# EAGLE design Breakout3v2 (EAGLE 9.0.1)
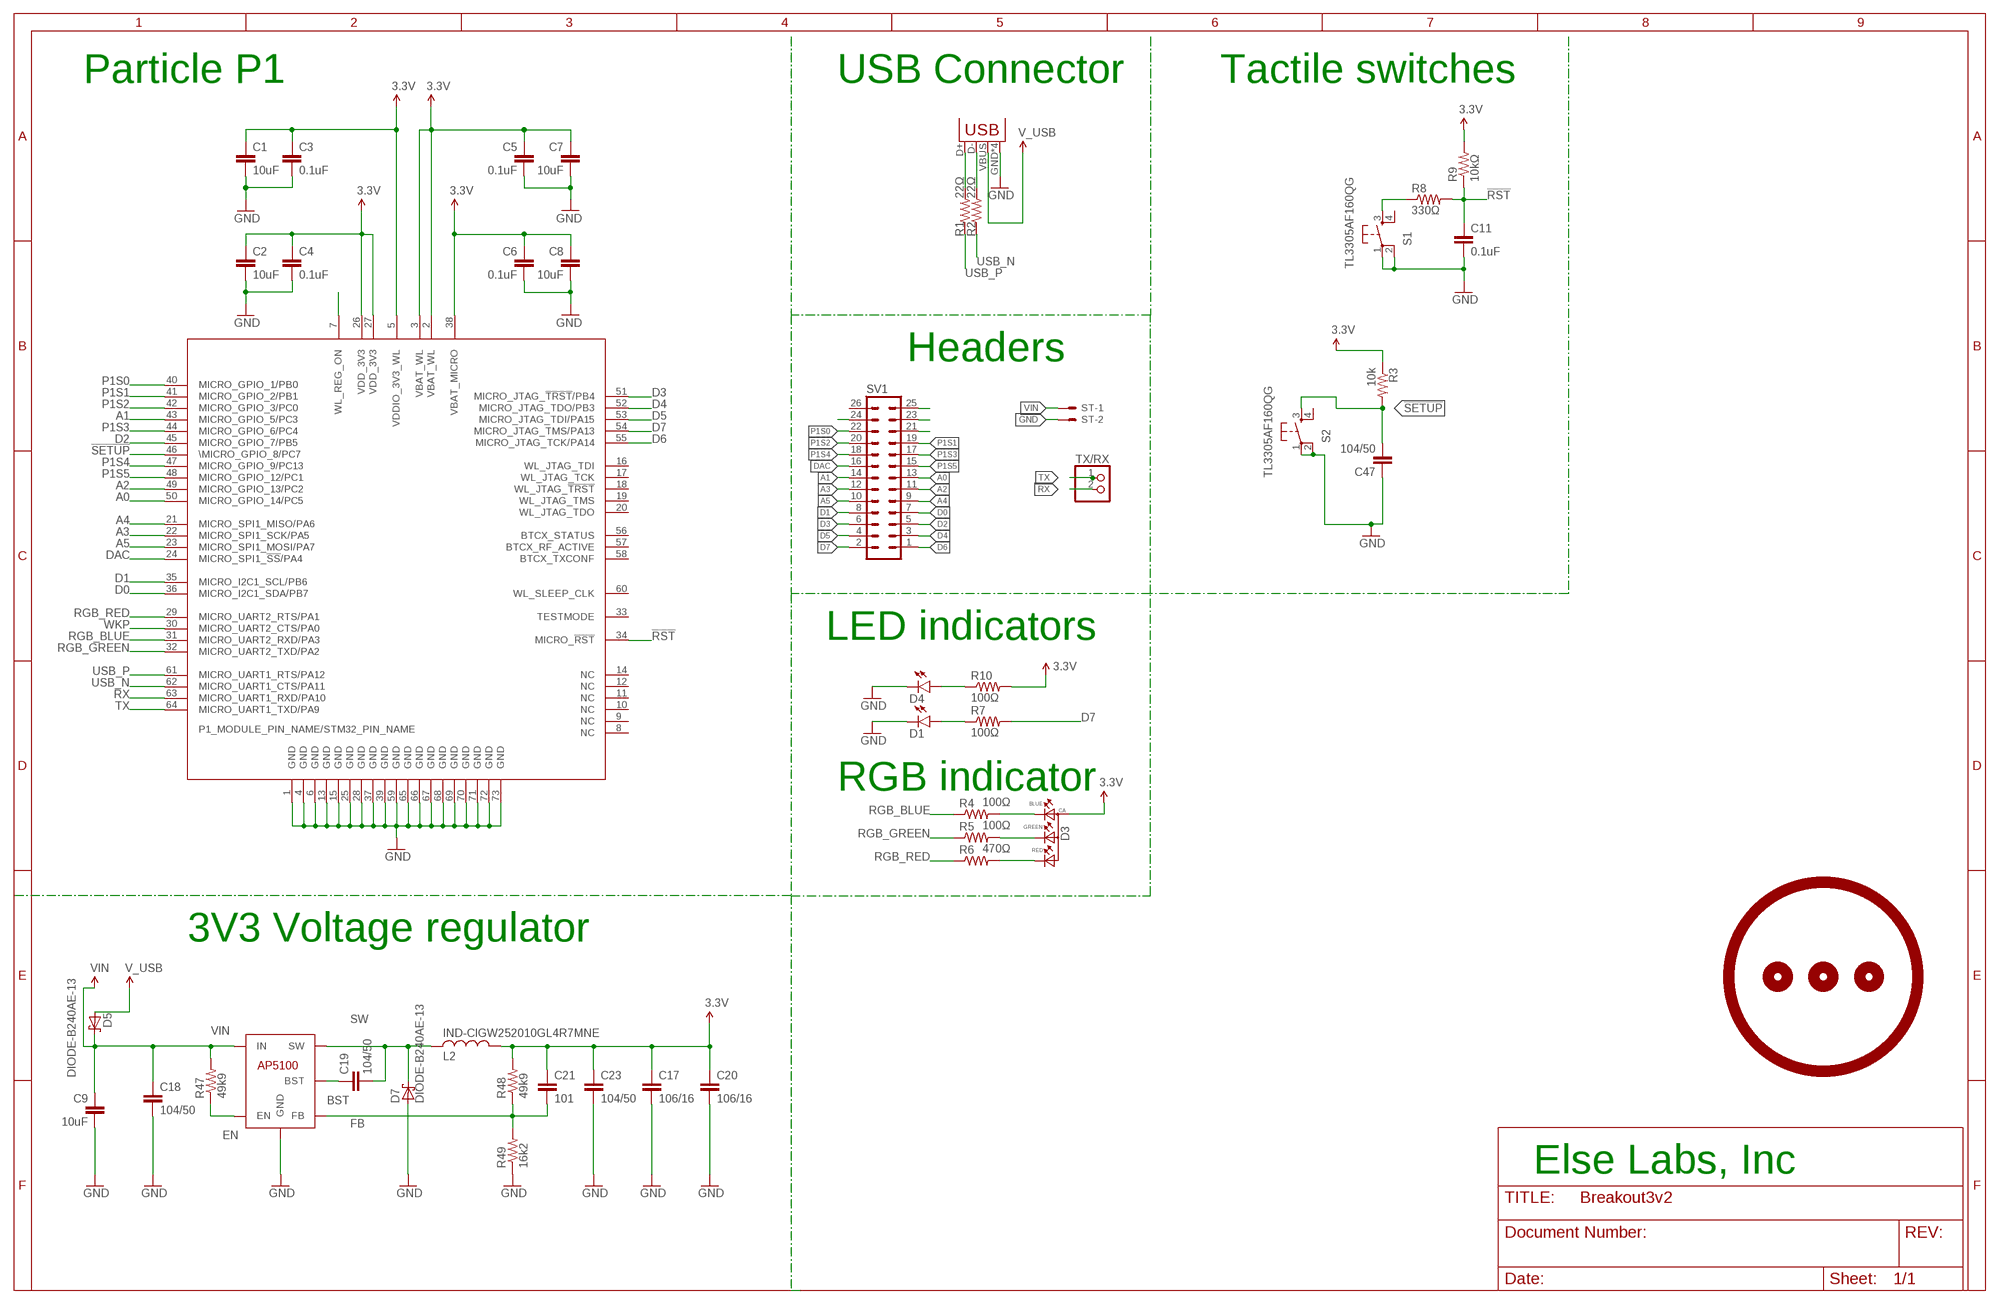
[diagram p0: schematic, sheet 1]

## Parts
C1  10uF  CAP0805  [0805]
C2  10uF  CAP0805  [0805]
C3  0.1uF  CAP0805  [0805]
C4  0.1uF  CAP0805  [0805]
C5  0.1uF  CAP0805  [0805]
C6  0.1uF  CAP0805  [0805]
C7  10uF  CAP0805  [0805]
C8  10uF  CAP0805  [0805]
C9  10uF  CAP0805  [0805]
C11  0.1uF  CAP0805  [0805]
C17  106/16  C-EUC0805  [C0805]
C18  104/50  C-EUC0603  [C0603]
C19  104/50  C-EUC0603  [C0603]
C20  106/16  C-EUC0805  [C0805]
C21  101  C-EUC0603  [C0603]
C23  104/50  C-EUC0603  [C0603]
C47  104/50  C-EUC0603  [C0603]
D1  LED0603  [LED-0603]
D3  CLVBA-FKAPLCC  [4-PLCC]
D4  LED0603  [LED-0603]
D5  DIODE-B240AE-13  [DO-214AC]
D7  DIODE-B240AE-13  [DO-214AC]
IC5  SMSP-BUCK-AP5100  [SOT23-6]
JP1  USBUSB-MICROB-SLOT-HOLE  [USB-MICROB-SLOT-HOLE]
L2  IND-CIGW252010GL4R7MNE  [L2520]
R1  22Ω  RESISTOR0805-RES  [0805]
R2  22Ω  RESISTOR0805-RES  [0805]
R3  10k  R-US_R0603  [R0603]
R4  100Ω  RESISTOR0805-RES  [0805]
R5  100Ω  RESISTOR0805-RES  [0805]
R6  470Ω  RESISTOR0805-RES  [0805]
R7  100Ω  RESISTOR0805-RES  [0805]
R8  330Ω  RESISTOR0805-RES  [0805]
R9  10kΩ  RESISTOR0805-RES  [0805]
R10  100Ω  RESISTOR0805-RES  [0805]
R47  49k9  R-US_R0603  [R0603]
R48  49k9  R-US_R0603  [R0603]
R49  16k2  R-US_R0603  [R0603]
S1  TL3305AF160QG  SWITCH-MOMENTARY-4.5MX4.5M  [TACTILE_SWITCH_SMD_4.5X4.5MM]
S2  TL3305AF160QG  SWITCH-MOMENTARY-4.5MX4.5M  [TACTILE_SWITCH_SMD_4.5X4.5MM]
ST  22-27-2021-02  [6410-02]
SV1  MA13-2  [MA13-2]
TX/RX  PINHD-1X2  [1X02]
U$1  LOGO  [LOGO]
UC1  P1  [WM-N-BM-14]

## Nets
3.3V: C1.1 C2.1 C3.1 C4.1 C5.1 C6.1 C7.1 C8.1 C17.1 C20.1 C21.1 C23.1 D3.2(ANODE) L2.P$1 R3.1 R9.2 R10.2 R48.2 UC1.2(VBAT_WL) UC1.3(VBAT_WL) UC1.5(VDDIO_3V3_WL) UC1.26(VDD_3V3) UC1.27(VDD_3V3) UC1.38(VBAT_MICRO)
!RST: C11.1 R8.2 R9.1 UC1.34(MICRO_!RST!)
!SETUP: C47.2 R3.2 S2.3 UC1.46(\MICRO_GPIO_8/PC7)
A0: SV1.13 UC1.50(MICRO_GPIO_14/PC5)
A1: SV1.14 UC1.43(MICRO_GPIO_5/PC3)
A2: SV1.11 UC1.49(MICRO_GPIO_13/PC2)
A3: SV1.12 UC1.22(MICRO_SPI1_SCK/PA5)
A4: SV1.9 UC1.21(MICRO_SPI1_MISO/PA6)
A5: SV1.10 UC1.23(MICRO_SPI1_MOSI/PA7)
BLR: D3.3(BLUE) R4.2
BST: C19.1 IC5.1(BST)
D0: SV1.7 UC1.36(MICRO_I2C1_SDA/PB7)
D1: SV1.8 UC1.35(MICRO_I2C1_SCL/PB6)
D2: SV1.5 UC1.45(MICRO_GPIO_7/PB5)
D3: SV1.6 UC1.51(MICRO_JTAG_!TRST!/PB4)
D4: SV1.3 UC1.52(MICRO_JTAG_TDO/PB3)
D5: SV1.4 UC1.53(MICRO_JTAG_TDI/PA15)
D6: SV1.1 UC1.55(MICRO_JTAG_TCK/PA14)
D7: R7.2 SV1.2 UC1.54(MICRO_JTAG_TMS/PA13)
DAC: SV1.16 UC1.24(MICRO_SPI1_!SS!/PA4)
EN: IC5.4(EN) R47.1
FB: C21.2 IC5.3(FB) R48.1 R49.2
GND [USB]: C1.2 C2.2 C3.2 C4.2 C5.2 C6.2 C7.2 C8.2 C9.2 C11.2 C17.2 C18.2 C20.2 C23.2 C47.1 D1.C D4.C D7.A IC5.2(GND) JP1.GND JP1.P$1(GND) JP1.P$2(GND) JP1.P$3(GND) R49.1 S1.1 S1.2 S2.1 S2.2 ST.2 UC1.1(GND) UC1.4(GND) UC1.6(GND) UC1.13(GND) UC1.15(GND) UC1.25(GND) UC1.28(GND) UC1.37(GND) UC1.39(GND) UC1.59(GND) UC1.65(GND) UC1.66(GND) UC1.67(GND) UC1.68(GND) UC1.69(GND) UC1.70(GND) UC1.71(GND) UC1.72(GND) UC1.73(GND)
GRR: D3.4(GREEN) R5.2
N$2: JP1.D+ R1.2
N$3: JP1.D- R2.2
N$6: D1.A R7.1
N$7: R8.1 S1.3
N$9: D4.A R10.1
N$29: SV1.21
N$31: SV1.23
N$32: SV1.24
N$33: SV1.25
N$43: UC1.7(WL_REG_ON)
P1S0: SV1.22 UC1.40(MICRO_GPIO_1/PB0)
P1S1: SV1.19 UC1.41(MICRO_GPIO_2/PB1)
P1S2: SV1.20 UC1.42(MICRO_GPIO_3/PC0)
P1S3: SV1.17 UC1.44(MICRO_GPIO_6/PC4)
P1S4: SV1.18 UC1.47(MICRO_GPIO_9/PC13)
P1S5: SV1.15 UC1.48(MICRO_GPIO_12/PC1)
RER: D3.1(RED) R6.2
RGB_BLUE: R4.1 UC1.31(MICRO_UART2_RXD/PA3)
RGB_GREEN: R5.1 UC1.32(MICRO_UART2_TXD/PA2)
RGB_RED: R6.1 UC1.29(MICRO_UART2_RTS/PA1)
RX: TX/RX.2 UC1.63(MICRO_UART1_RXD/PA10)
SW: C19.2 D7.C IC5.6(SW) L2.P$2
TX: TX/RX.1 UC1.64(MICRO_UART1_TXD/PA9)
USB_N: R2.1 UC1.62(MICRO_UART1_CTS/PA11)
USB_P: R1.1 UC1.61(MICRO_UART1_RTS/PA12)
V_USB: D5.A JP1.VBUS
VIN: C9.1 C18.1 D5.C IC5.5(IN) R47.2 ST.1
WKP: UC1.30(MICRO_UART2_CTS/PA0)
Unconnected: S1.4 S2.4 SV1.26 UC1.8(NC) UC1.9(NC) UC1.10(NC) UC1.11(NC) UC1.12(NC) UC1.14(NC) UC1.16(WL_JTAG_TDI) UC1.17(WL_JTAG_TCK) UC1.18(WL_JTAG_!TRST!) UC1.19(WL_JTAG_TMS) UC1.20(WL_JTAG_TDO) UC1.33(TESTMODE) UC1.56(BTCX_STATUS) UC1.57(BTCX_RF_ACTIVE) UC1.58(BTCX_TXCONF) UC1.60(WL_SLEEP_CLK)

## Notes on the sheet
- Particle P1 | USB Connector | Tactile switches
- Headers
- LED indicators
- RGB indicator
- 3V3 Voltage regulator
- Else Labs, Inc

## Library data of the parts
C1-C9 C11 = SparkFun-Capacitors:CAP: Capacitor Standard 0603 ceramic capacitor, and 0.1" leaded capacitor.
C17-C21 C23 C47 = rcl:C-EU: CAPACITOR, European symbol; SPICEPREFIX: C
D1 D4 = SparkFun-LED:LED: LEDs Standard schematic elements and footprints for 5mm, 3mm, 1206, and 0603 sized LEDs. 5mm - Spark Fun Electronics SKU : COM-00529 (and others)
D3 = ElseLabs:CLVBA-FKA: Everlight Red/Green/Blue LED 67-23/R6GHBHC-B01/2T || 67-23/R6GHBH-B01 Size 3.2*2.8*1.9mm Mounting Type SMD Full-Color LED PLCC4 Emitting Color Red/Green/Blue (620-625/530-535/470-475 nm) Chip Material AlGaInP/InGaN/InGaN Luminous Intensity 57-112/225-450/36-72 mcd Viewing Angle 120 deg Lens Type-Color Water Clear Forward Voltage 2.0/3.5/3.5 V Forward Current 10 mA Maximum Forward Voltage 2.4/3.9/3.9 V Maximum Forward Current 25/25/25 mA Min-Max Operating Temperature -40C to +85C Factory Pack 2000 pcs-Reel RoHS ✓; PROD_ID: DIO-12986
D5 D7 = TAHI EagleCAD part library:DIODE-B240AE-13
IC5 = TAHI EagleCAD part library:SMSP-BUCK-AP5100
JP1 = ElseLabs:USB
L2 = TAHI EagleCAD part library:IND-CIGW252010GL4R7MNE
R1 R2 R4-R10 = SparkFun-Resistors:RESISTOR: Resistor Basic schematic elements and footprints for 0603, 1206, and PTH resistors.
R3 R47-R49 = rcl:R-US_: RESISTOR, American symbol; SPICEPREFIX: R
S1 S2 = ElseLabs:SWITCH-MOMENTARY
ST = con-molex:22-?-02: CONNECTOR wire to board 2.54 mm (.1 inch) pitch header; MF: MOLEX; OC_FARNELL: unknown; OC_NEWARK: unknown
SV1 = con-lstb:MA13-2: PIN HEADER; OC_FARNELL: unknown; OC_NEWARK: unknown
TX/RX = pinhead:PINHD-1X2: PIN HEADER
U$1 = ElseLabs:LOGO
UC1 = TAHI-brd-1v48:P1: Particle P1 module (WiFi with antenna)

## Net classes
0 default: width 0.203 mm, drill 0.35 mm, clearance 0.178 mm
1 USB: width 0.191 mm, drill 0.35 mm, clearance 0.356 mm

## Board
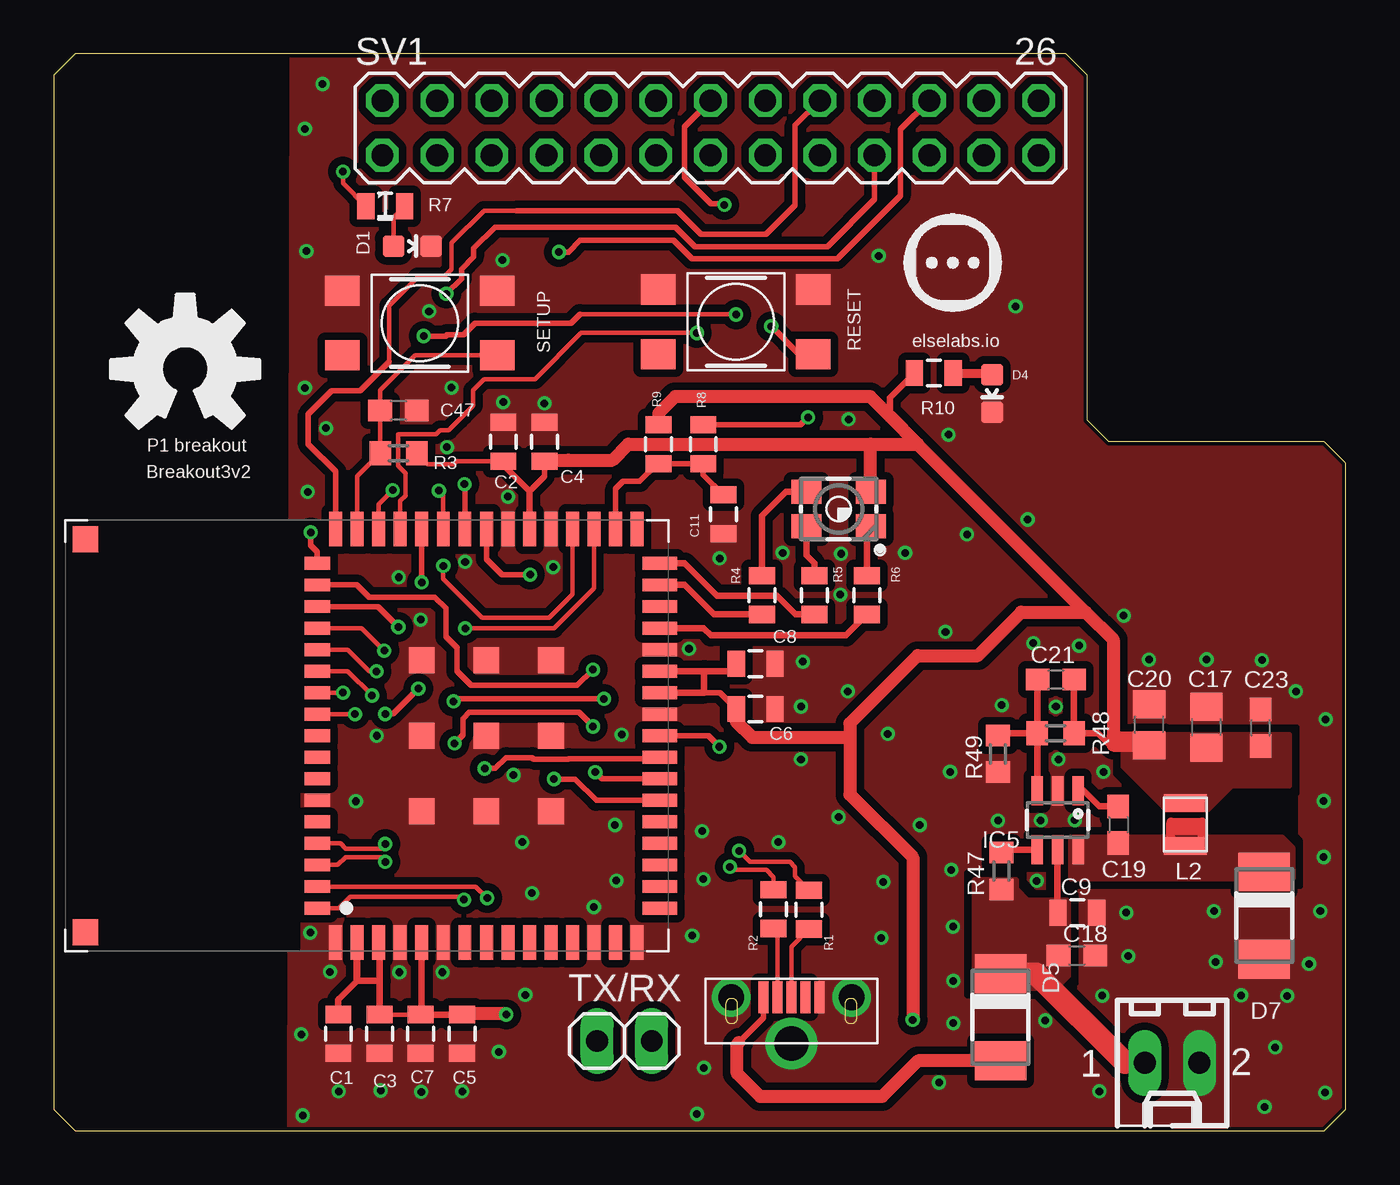
[diagram p1: board, top side]
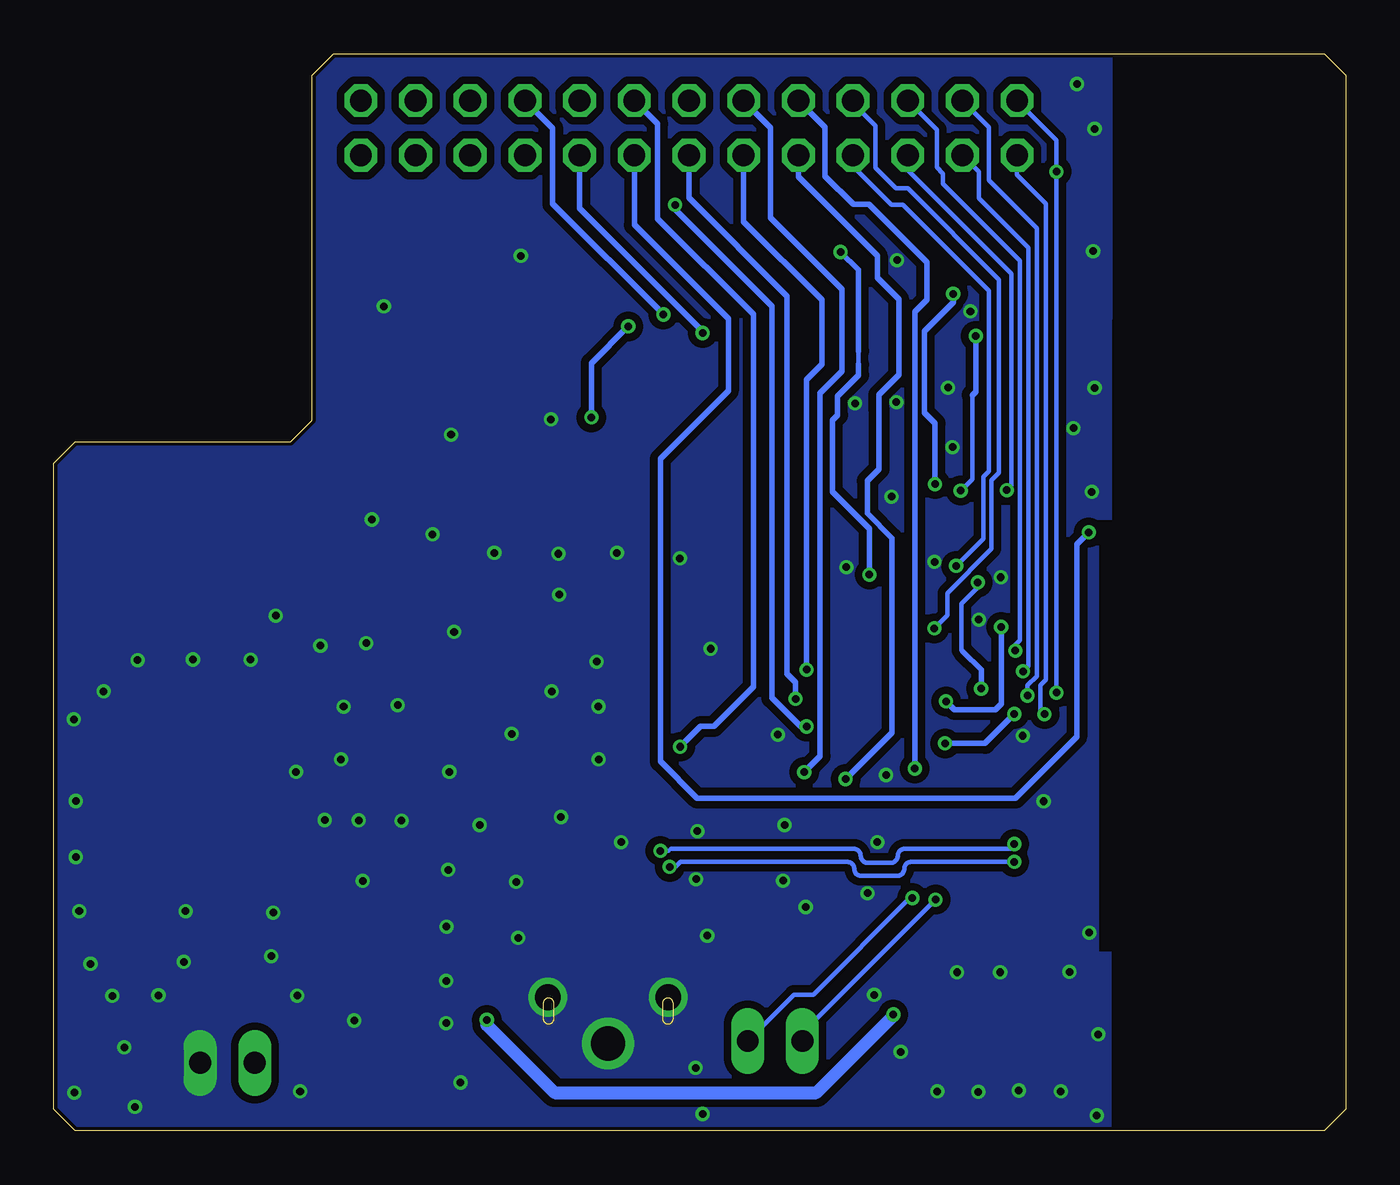
[diagram p2: board, bottom side, seen from below]

Size 60 x 50 mm. Coordinates in mm from the lower left corner, seen from the top.
Outline: 0,1 1,0 59,0 60,1 60,31 59,32 49,32 48,33 48,49 47,50 1,50 0,49 0,1
Copper layers (1*16): Top 0.035mm / dielectric 1.5mm / Bottom 0.035mm
Design rules "PCBway *": minimum track width 6mil, minimum drill 0.35mm, track to track 6mil, track to pad 6mil, pad to pad 6mil, via to via 6mil, smd to smd 0mil, copper to edge 7mil, drill to drill 6mil, minimum pad ring 6mil, minimum via ring 6mil, stop-mask expansion 2mil, vias tented up to drill 25mil, thermal gap 10mil

### Footprints (pad centres in the part's own frame; a part is rotated, then mirrored left to right if it is on the bottom)
0805 = smd 0.8 x 1.2: 1 -0.9,0; 2 0.9,0
C0805 = smd 1.3 x 1.5: 1 -0.95,0; 2 0.95,0
C0603 = smd 1.1 x 1: 1 -0.85,0; 2 0.85,0
LED-0603 = smd 1 x 1: A 0,-0.877; C 0,0.877
4-PLCC = smd 1.4 x 1.1: 1 -1.5,0.8; 2 -1.5,-0.8; 3 1.5,-0.8; 4 1.5,0.8
DO-214AC = smd 1.8 x 2.4: A 2.025,0; C -2.025,0
SOT23-6 = smd 0.55 x 1.35: 1 -0.95,-1.375; 2 0,-1.375; 3 0.95,-1.375; 4 0.95,1.375; 5 0,1.375; 6 -0.95,1.375
USB-MICROB-SLOT-HOLE = smd 0.45 x 1.5: D+ 0,0.635; D- -0.65,0.635; GND 1.3,0.635; ID 0.65,0.635; VBUS -1.3,0.635 | drill 1.2: P$1 2.8,0.635; P$2 -2.8,0.635 | drill 1.6: P$3 0,-1.515
L2520 = smd 0.8 x 2: P$1 -1,0; P$2 1,0
R0603 = smd 1 x 1.1: 1 -0.85,0; 2 0.85,0
TACTILE_SWITCH_SMD_4.5X4.5MM = smd 1.6 x 1.4: 1 -3.6,-1.5; 2 3.6,-1.5; 3 -3.6,1.5; 4 3.6,1.5
6410-02 = drill 1.016 long: 1 1.27,0; 2 -1.27,0
MA13-2 = drill 1.016 octagon: 1 -15.24,-1.27; 2 -15.24,1.27; 3 -12.7,-1.27; 4 -12.7,1.27; 5 -10.16,-1.27; 6 -10.16,1.27; 7 -7.62,-1.27; 8 -7.62,1.27; 9 -5.08,-1.27; 10 -5.08,1.27; 11 -2.54,-1.27; 12 -2.54,1.27; 13 0,-1.27; 14 0,1.27; 15 2.54,-1.27; 16 2.54,1.27; 17 5.08,-1.27; 18 5.08,1.27; 19 7.62,-1.27; 20 7.62,1.27; 21 10.16,-1.27; 22 10.16,1.27; 23 12.7,-1.27; 24 12.7,1.27; 25 15.24,-1.27; 26 15.24,1.27
1X02 = drill 1.016 long: 1 -1.27,0; 2 1.27,0
WM-N-BM-14 = smd 1.6 x 0.6: 1 0.4,15.45; 2 0.4,14.45; 3 0.4,13.45; 4 0.4,12.45; 5 0.4,11.45; 6 0.4,10.45; 7 0.4,9.45; 8 0.4,8.45; 9 0.4,7.45; 10 0.4,6.45; 11 0.4,5.45; 12 0.4,4.45; 13 0.4,3.45; 14 0.4,2.45; 15 0.4,1.45; 33 19.6,1.45; 34 19.6,2.45; 35 19.6,3.45; 36 19.6,4.45; 37 19.6,5.45; 38 19.6,6.45; 39 19.6,7.45; 40 19.6,8.45; 41 19.6,9.45; 42 19.6,10.45; 43 19.6,11.45; 44 19.6,12.45; 45 19.6,13.45; 46 19.6,14.45; 47 19.6,15.45 | smd 0.6 x 1.6: 16 2,0.4; 17 3,0.4; 18 4,0.4; 19 5,0.4; 20 6,0.4; 21 7,0.4; 22 8,0.4; 23 9,0.4; 24 10,0.4; 25 11,0.4; 26 12,0.4; 27 13,0.4; 28 14,0.4; 29 15,0.4; 30 16,0.4; 31 17,0.4; 32 18,0.4 | smd 0.6 x 1.2: 48 18,16.3; 49 17,16.3; 50 16,16.3; 51 15,16.3; 52 14,16.3; 53 13,16.3; 54 12,16.3; 55 11,16.3; 56 10,16.3; 57 9,16.3; 58 8,16.3; 59 7,16.3; 60 6,16.3; 61 5,16.3; 62 4,16.3; 63 3,16.3; 64 2,16.3 | smd 1.2 x 1.2: 65 6.5,11.45; 66 6.5,8.45; 67 6.5,5.45; 68 10,11.45; 69 10,8.45; 70 10,5.45; 71 13.5,11.45; 72 13.5,8.45; 73 13.5,5.45; 74 19.12,27.07; 75 0.88,27.07

### Placement (x,y rotation side)
C1  13.21,4.5 270 top
C2  20.88,31.99 90 top
C3  15.13,4.5 270 top
C4  22.79,31.99 90 top
C5  18.95,4.5 270 top
C6  32.59,19.59 0 top
C7  17.04,4.5 270 top
C8  32.59,21.68 0 top
C9  47.53,10.12 0 top
C11  31.11,28.62 270 top
C17  53.53,18.74 90 top
C18  47.51,8.13 0 top
C19  49.44,14.21 270 top
C20  50.87,18.86 90 top
C21  46.54,20.95 180 top
C23  56.05,18.71 90 top
C47  16.01,33.44 180 top
D1  16.65,41.08 270 top
D3  36.45,28.87 180 top
D4  43.58,34.23 180 top
D5  43.97,5.27 270 top
D7  56.21,9.99 270 top
IC5  46.62,14.42 180 top
JP1  34.26,5.56 0 top
L2  52.56,14.22 270 top
R1  35.08,10.27 270 top
R2  33.43,10.29 270 top
R3  16.01,31.46 180 top
R4  32.88,24.87 90 top
R5  35.33,24.87 90 top
R6  37.77,24.87 90 top
R7  15.39,42.92 180 top
R8  30.16,31.88 270 top
R9  28.09,31.88 90 top
R10  40.87,35.18 180 top
R47  44.01,12.06 270 top
R48  46.53,18.46 0 top
R49  43.85,17.5 90 top
S1  31.68,37.56 180 top
S2  17,37.5 180 top
ST  51.94,3.15 180 top
SV1  30.5,46.56 0 top
TX/RX  26.5,4.17 0 top
U$1  39.48,38.03 0 top
U$3  [OSHW-LOGO-L]  6.1,35.36 0 top
UC1  28.54,8.34 90 top

### Tracks (layer width: path | path; a pad name or v marks a point on that pad's centre or on a via)
3.3V  (via drill 0.35)
  Top 0.2: C2.1 18.72,31.09 18.58,30.96 17.36,30.96 R3.1
  Top 0.203: 17.07,5.4 C7.1 C3.1 15.14,6.96 | 15.14,8.74 UC1.3 | C1.1 13.21,6.16
  Top 0.254: C6.1 30.93,20.34 30.2,20.34 | C2.1 20.88,30.91 22.09,29.7 22.79,30.39 C4.1 23.85,31.09 23.9,31.14
  Top 0.305: C21.1 R48.2 48.49,18.46 49.04,17.91 49.2,17.91 | C5.1 17.23,5.4 | 14.09,6.96 15.14,6.96 15.14,8.74 15.13,8.73 C3.1 | 14.09,6.96 UC1.2 14.07,8.72 14.07,7.01 | 31.69,21.61 C8.1 31.69,21.34 30.2,21.34 | UC1.38 22.09,29.7 | UC1.27 30.2,21.34 | UC1.26 30.2,20.34 30.2,21.34 | UC1.5 17.09,5.54 17.23,5.4 | C7.1 17.23,5.4 | C1.1 13.21,6.08 14.09,6.96 | 38.84,33.16 38.84,34.04 R10.2
  Top 0.406: C20.1 50.46,18.32 49.2,18.32
  Top 0.61: C5.1 18.99,5.43 20.98,5.43 v21.01,5.4 | 47.92,24.08 44.93,24.08 42.91,22.07 40.12,22.07 36.97,18.92 36.97,18.28 | 47.92,24.08 49.2,22.8 49.2,18.32 49.2,17.91 C20.1 | 40.12,31.88 47.92,24.08 | 23.14,31.14 23.9,31.14 25.94,31.14 26.68,31.88 37.93,31.88 | 37.93,31.88 40.12,31.88 | 40.12,31.88 38.84,33.16 37.92,34.08 28.86,34.08 28.09,33.3 R9.2 | D3.2 37.93,29.69 37.93,31.88 | 36.97,18.28 36.97,15.61 39.89,12.69 v39.89,5.15 | C6.1 31.69,19 32.43,18.26 36.95,18.26 36.97,18.28
  Bottom 0.61: v39.89,5.15 39.89,4.92 36.74,1.77 24.58,1.77 21.01,5.34 v21.01,5.4
  pour Top (no thermals): 53.57,14.9 54.69,16.02 57.37,16.02 57.37,18.38 49.67,18.38 49.67,16.93 51.7,14.9
!RST
  Top 0.203: 26.09,29.11 UC1.34
  Top 0.254: UC1.34 26.09,29.8 26.44,30.15 27.21,30.15 28.04,30.98 R9.1 R8.2 30.16,30.47 C11.1
!SETUP
  Top 0.2: UC1.46 14.09,30.39 R3.2 C47.2 15.16,34.39 16.36,35.59 | 16.77,36 S2.3
  Top 0.203: 16.36,35.59 16.77,36
A0  (via drill 0.35)
  Top 0.254: v18.56,19.94 18.56,20.05 v25.55,20.05 | UC1.50 15.05,24.34 v16,23.39
  Bottom 0.254: v25.55,20.05 25.55,20.82 25.94,21.21 25.94,38.75 30.5,43.31 SV1.13 | v16,23.39 16,19.82 16.27,19.55 18.17,19.55 v18.56,19.94
A1  (via drill 0.35)
  Top 0.254: UC1.43 v17.09,25.46 | v31.14,42.99 31.1,43.03 30.53,43.03 29.29,44.27 29.29,46.62 SV1.14 | v18.61,17.99 19.01,18.39 19.01,19.14 19.29,19.42 24.39,19.42 v25.04,18.77 | v16.93,20.53 15.75,19.35 v15.39,19.35
  Bottom 0.2: v17.09,25.46 17.09,25.23 17.84,24.48
  Bottom 0.203: 17.77,22.25 17.84,22.31 17.84,24.48
  Bottom 0.254: v31.14,42.99 31.14,42.78 26.65,38.29 26.65,20.1 25.32,18.77 v25.04,18.77 | 18.7,18.08 v18.61,17.99 16.75,17.99 v15.39,19.35 | 17.77,22.25 16.93,21.4 v16.93,20.53
A2  (via drill 0.35)
  Top 0.254: v25.04,21.41 24.31,20.68 19.37,20.68 18.72,21.33 18.72,22.42 18.21,22.93 18.21,24.26 17.69,24.78 14.64,24.78 14.07,25.35 14.06,25.34 UC1.49
  Bottom 0.254: v25.04,21.41 25.04,34.87 24.33,35.58 24.33,38.58 27.96,42.21 SV1.11
A3  (via drill 0.35)
  Top 0.254: UC1.22 25.46,16.34 v25.15,16.65
  Bottom 0.254: 24.75,17.05 v25.15,16.65 24.41,17.39 24.41,34.24 23.39,35.26 23.39,39.08 26.7,42.4 26.7,46.58 SV1.12
A4  (via drill 0.35)
  Top 0.254: UC1.21 25.2,15.34 24.21,16.33 v23.23,16.33
  Bottom 0.254: SV1.9 25.42,44.29 21.75,40.62 21.75,39.6 20.75,38.6 20.75,35.1 21.68,34.17 21.68,33.49 21.67,33.48 21.67,30.72 22.22,30.17 22.22,28.66 21.07,27.51 21.07,18.49 v23.23,16.33
A5  (via drill 0.35)
  Top 0.254: v20.01,16.82 20.5,16.82 21.01,17.33 22.22,17.33 22.29,17.26 23.89,17.26 23.91,17.28 28.08,17.28 UC1.23
  Bottom 0.254: v20.01,16.82 20.01,38.02 19.45,38.58 19.45,40.32 22.14,43.01 22.87,43.01 24.18,44.32 24.18,46.59 SV1.10
BLR
  Top 0.203: D3.3 34.84,29.78
  Top 0.305: R4.2 32.88,28.55 34,29.67 D3.3
BST
  Top 0.305: C19.1 48.56,15.06 47.83,15.79 IC5.1
D0  (via drill 0.35)
  Top 0.203: UC1.36 24.09,24.92 23,23.83 19.9,23.83 18.09,25.64 v18.09,26.23
  Bottom 0.203: v18.09,26.23 16.83,27.49 16.83,30.37 16.57,30.63 16.57,32.51 16.57,39 20.56,42.99 21.09,42.99 22.88,44.78 SV1.7
D1  (via drill 0.35)
  Top 0.203: v19.11,23.32 23.23,23.32 25.09,25.18 UC1.35
  Bottom 0.2: 16.45,27.01 18.5,24.97
  Bottom 0.203: SV1.8 23,47.83 21.83,46.66 21.83,44.7 20.88,43.75 20.34,43.75 16.1,39.51 16.1,30.56 16.45,30.21 16.45,27.01 | v19.11,23.32 18.5,23.93 18.5,24.97
D2  (via drill 0.35)
  Top 0.203: UC1.45 15.09,29.1 v15.74,29.75
  Bottom 0.203: v15.74,29.75 15.53,29.95 15.53,39.78 20.34,44.59 SV1.5
D3  (via drill 0.35)
  Top 0.203: v15.35,22.29 14.3,23.34 UC1.51
  Bottom 0.203: v15.35,22.29 15.35,22.56 15.13,22.78 15.13,40.39 15.8,41.06 18.7,43.97 18.7,44.44 19,44.73 19,46.48 SV1.6
D4  (via drill 0.35)
  Top 0.203: UC1.52 13.64,22.34 14.65,21.33 v14.99,21.33
  Bottom 0.203: v14.99,21.33 14.74,21.58 14.74,41 16.46,42.72 17.04,43.3 17.04,44.52 SV1.3
D5  (via drill 0.35)
  Top 0.203: UC1.53 13.65,21.34 v14.78,20.21
  Bottom 0.203: v14.78,20.21 14.78,20.68 14.35,21.11 14.35,41.91 16.56,44.12 16.56,46.59 SV1.4
D6  (via drill 0.35)
  Top 0.203: UC1.55 v13.99,19.34
  Bottom 0.203: v13.99,19.34 14.17,19.52 14.17,20.68 13.92,20.93 13.92,43.04 15.26,44.38 SV1.1
D7  (via drill 0.35)
  Top 0.2: R7.2 13.43,43.98 v13.43,44.52
  Top 0.203: v13.43,44.52 v13.43,44.53 | UC1.54 v13.43,20.34
  Bottom 0.203: v13.43,20.34 v13.43,44.53 13.43,46 SV1.2
DAC  (via drill 0.35)
  Top 0.254: UC1.24 30.4,18.34 v30.91,17.83
  Bottom 0.254: v30.91,17.83 29.96,18.78 29.35,18.78 27.51,20.62 27.51,37.9 31.96,42.35 31.96,46.75 SV1.16
EN
  Top 0.305: IC5.4 44.15,13.04 R47.1
FB
  Top 0.305: C21.2 R48.1 | R48.1 IC5.3 | R48.1 43.96,18.46 R49.2
GND  (via drill 0.35)
  other vias: 47.42,14.43 45.84,14.41 46.66,17.24 44.03,19.76 56.11,21.85 53.54,21.88 50.86,21.87 48.75,16.66 43.85,14.4 58.3,7.75 57.28,6.26 55.14,6.29 53.96,7.84 53.88,10.2 49.9,8.11 49.81,10.13 41.78,5 41.78,6.96 41.76,9.48 41.68,12.11 41.63,16.66 45.65,11.6 58.82,10.2 48.69,6.27 46.05,5.12 46.54,19.69 59.07,19.1 34.7,17.24 58.98,12.71 58.98,15.31 57.69,20.4 13.23,1.83 15.18,1.87 17.06,1.81 18.97,1.83 20.67,3.66 12.83,7.38 16.05,7.36 18.05,7.36 14.03,15.3 29.5,22.38 21.09,29.44 25.08,10.39 20.87,33.83 22.79,33.77 33.85,26.83 36.56,26.79 36.53,24.89 34.79,21.78 34.71,19.7 39.54,26.83 41.41,23.16 38.31,40.62 45.49,22.64 47.62,22.52 18.47,34.5 30.92,26.58 26.06,14.2 26.13,11.62 40.22,14.2 38.73,18.43 36.88,20.4 59.05,1.77 44.67,38.28 20.84,40.42 16.02,25.7 21.75,13.4 22.21,11.03 30.17,11.68 29.65,9.06 30.11,13.91 33.65,13.4 36.91,33.03 41.55,32.32 45.23,28.38 42.41,27.69 49.69,23.92 41.11,2.24 48.56,1.83 38.43,8.96 38.53,11.56 36.45,14.57 21.9,6.31 30.19,2.92 29.87,0.78 11.49,4.48 11.56,0.71 12.48,48.6 11.66,46.52 11.73,40.84 11.66,34.49 12.64,32.62 11.79,29.66 19.1,26.41 23.19,26.17 15,18.34 56.23,1.11 56.73,3.87 26.37,18.39 11.91,9.2 21.35,16.52 17.04,23.73 18.26,31.74 17.43,38.04
  pour Bottom (no thermals): 61.82,50.31 10.92,50.26 10.97,-0.13 61.72,-0.33
  pour Top (rank 2, no thermals): 10.93,-0.14 11.05,50.3 50.1,50.59 50.1,-0.01
  pour Top (rank 2, no thermals): 49.77,18.7 57.96,18.7 58,11.3 50.17,11.3 50.17,0 60.94,-0.33 60.94,33.36 49.88,33.36
GRR
  Top 0.203: 34.9,28.02 D3.4
  Top 0.305: R5.2 35.33,26.34 34.95,26.72 D3.4
N$2
  Top 0.203: R1.2 34.26,8.55 JP1.D+
N$3
  Top 0.203: 33.43,9.15 R2.2 33.61,9.21 JP1.D-
N$6
  Top 0.2: R7.1 15.77,42.41 D1.A
N$7  (via drill 0.35)
  Top 0.254: R8.1 34.69,32.77 v35.03,33.12 | v33.32,37.35 34.61,36.06 S1.3
  Bottom 0.254: v35.03,33.12 35.03,35.64 v33.32,37.35
N$9
  Top 0.406: R10.1 43.51,35.18 D4.A
P1S0  (via drill 0.35)
  Top 0.254: SV1.22 39.32,46.49 39.32,43.41 36.63,40.73 36.4,40.49 29.63,40.49 28.77,41.35 24.45,41.35 23.9,40.8 v23.46,40.8 | UC1.40 20.09,26.54 20.81,25.82 v22.12,25.82
  Bottom 0.203: 22.63,35.44 22.63,35.58 22.63,36.2 22.63,39.22
  Bottom 0.254: 22.63,36.2 22.63,39.97 v23.46,40.8 | 22.63,35.58 22.63,35.08 23.6,34.11 23.6,33.23 23.84,32.99 23.84,29.67 22.12,27.95 v22.12,25.82
P1S1  (via drill 0.35)
  Top 0.254: UC1.41 19.09,30 v19.07,30.02 | SV1.19 38.12,43.24 35.92,41.04 29.78,41.04 28.86,41.95 20.48,41.95 19.5,40.97 19.5,40.58 18.93,40.01 18.93,39.56 v18.23,38.86
  Bottom 0.254: v19.07,30.02 19.07,32.85 19.57,33.35 19.57,37.12 18.23,38.46 v18.23,38.86
P1S2  (via drill 0.35)
  Top 0.2: 24.43,37.9 v31.69,37.9
  Top 0.203: UC1.42 18.09,29.51 v17.88,29.72
  Top 0.254: 24.43,37.9 24.26,37.73 24.03,37.5 19.56,37.5 19.02,36.96 18.26,36.96 18.2,36.9 v17.18,36.9
  Bottom 0.203: v17.88,29.72 17.34,30.26 17.34,34.15
  Bottom 0.254: v31.69,37.9 36.83,43.04 36.83,46.54 SV1.20 | v17.18,36.9 17.18,34.31 17.34,34.15
P1S3  (via drill 0.35)
  Top 0.2: 16.09,28.78 16.09,29.24 16.34,29.49 16.34,30.53 16.08,30.79 | 17.13,32.35 17.76,32.35 17.94,32.52 18.33,32.52 18.82,33.02
  Top 0.203: UC1.44 16.09,28.78 | v29.87,37.04 24.49,37.04 22.34,34.89 19.98,34.89 19.48,34.38 19.48,33.66 19.02,33.2 19.01,33.2 18.82,33.02 | 16.08,30.79 16,30.87 16,32.35 17.13,32.35
  Bottom 0.203: 29.87,37.13 v29.87,37.04
  Bottom 0.254: SV1.17 35.58,42.84 29.87,37.13
P1S4
  Top 0.203: 15.57,35.7 15.57,38.31 16.89,39.63 18.11,39.63 18.47,39.99 18.47,40.46 18.48,40.47 18.48,41.22 19.97,42.71 21.5,42.71
  Top 0.254: UC1.47 13.09,30.61 11.81,31.89 11.81,33.27 12.9,34.35 14.22,34.35 15.57,35.7 | SV1.18 34.43,46.68 34.43,42.96 33.09,41.62 30.05,41.62 28.96,42.71 21.5,42.71
P1S5  (via drill 0.35)
  Top 0.254: UC1.48 12.24,26.88 11.93,27.19 v11.93,27.78
  Bottom 0.254: SV1.15 33.04,42.06 28.67,37.69 28.67,34.35 31.83,31.19 31.83,17.15 30.12,15.44 15.34,15.44 12.49,18.29 12.49,25.41 12.49,27.22 v11.93,27.78
RER
  Top 0.203: 37.77,27.89 D3.1
  Top 0.305: R6.2 37.77,27.89
RGB_BLUE
  Top 0.305: UC1.31 29.29,25.34 30.66,23.97 R4.1
RGB_GREEN
  Top 0.305: UC1.32 29.3,26.34 30.81,24.83 33.58,24.83 34.44,23.97 R5.1
RGB_RED
  Top 0.305: UC1.29 30.18,23.34 30.52,23 36.8,23 R6.1
RX  (via drill 0.35)
  Top 0.2: 18.55,11.34 19.6,11.34 v20.13,10.81
  Top 0.203: UC1.63 18.55,11.34
  Bottom 0.2: v20.13,10.81 20.23,10.81 24.72,6.32 25.62,6.32 TX/RX.2
SW
  Top 0.406: L2.P$2 51.89,13.22 51.89,14.33 53.34,14.33 53.34,13.93 | 53.34,13.37 53.34,13.93 | 53.34,13.93 52.16,13.93
  pour Top (no thermals): 47.24,11.69 47.24,13.63 57.03,13.63 57.55,13.11 57.55,11.69
TX  (via drill 0.35)
  Top 0.203: UC1.64 13.23,10.34 13.75,10.86 18.92,10.86 v19.05,10.73
  Bottom 0.2: TX/RX.1 25.23,4.55 v19.05,10.73
USB_N  (via drill 0.35)
  Top 0.203: v15.39,12.48 15.39,12.71 13.56,12.71 13.19,12.34 UC1.62 | v31.4,12.25 31.54,12.11 33.09,12.11 33.43,11.77 R2.1
  Bottom 0.203: 15.39,12.71 v15.39,12.48 20.18,12.48 arc-90 20.5,12.16 arc90 20.83,11.84 22.5,11.84 arc90 22.82,12.16 arc-90 23.15,12.48 30.9,12.48 31.13,12.25 v31.4,12.25
USB_P  (via drill 0.35)
  Top 0.203: v15.39,13.32 15.39,13.09 13.56,13.09 13.31,13.34 UC1.61 | v31.83,13 32.34,12.49 34.18,12.49 34.42,12.24 34.42,11.82 R1.1
  Bottom 0.203: v15.39,13.32 15.39,13.09 20.48,13.09 arc-90 20.8,12.77 arc90 21.13,12.44 22.2,12.44 arc90 22.53,12.77 arc-90 22.85,13.09 31.34,13.09 31.44,12.99 v31.82,12.99 v31.83,13
V_USB
  Top 0.254: JP1.VBUS 32.96,5.24 31.73,4.01
  Top 0.61: D5.A 40.13,3.25 38.47,1.58 32.82,1.58 31.73,2.67 31.73,4.01 31.82,4.1
VIN
  Top 0.305: C9.1 IC5.5
  Top 1.016: ST.1 49.76,3.15 45.62,7.29 D5.C
  pour Top (no thermals): 42.77,6.64 46.54,6.64 47.09,7.19 47.09,10.64 47.06,10.67 45.3,10.67 45.27,10.64 44.68,11.23 44.68,11.62 42.77,11.62

### Text on the board
tPlace: SETUP | RESET
tNames: elselabs.io | P1 breakout | Breakout3v2